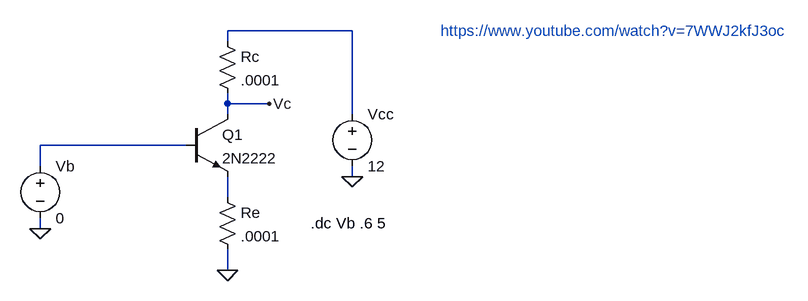
[diagram p0: schematic 2N2222A Input Characteristic Curve.asc]
2N2222A Input Characteristic Curve.asc, the LTspice schematic file:
Version 4
SHEET 1 1232 680
WIRE 448 16 256 16
WIRE 256 32 256 16
WIRE 256 128 256 112
WIRE 320 128 256 128
WIRE 256 144 256 128
WIRE 448 144 448 16
WIRE 192 192 -32 192
WIRE -32 224 -32 192
WIRE 448 240 448 224
WIRE 256 272 256 240
WIRE -32 320 -32 304
WIRE 256 384 256 352
FLAG 256 384 0
FLAG 448 240 0
FLAG 320 128 Vc
FLAG -32 320 0
SYMBOL npn 192 144 R0
SYMATTR InstName Q1
SYMATTR Value 2N2222
SYMBOL voltage 448 128 R0
WINDOW 123 0 0 Left 2
WINDOW 39 0 0 Left 2
SYMATTR InstName Vcc
SYMATTR Value 12
SYMBOL voltage -32 208 R0
SYMATTR InstName Vb
SYMATTR Value 0
SYMBOL res 240 16 R0
SYMATTR InstName Rc
SYMATTR Value .0001
SYMBOL res 240 256 R0
SYMATTR InstName Re
SYMATTR Value .0001
TEXT 384 312 Left 2 !.dc Vb .6 5
TEXT 584 16 Left 2 ;https://www.youtube.com/watch?v=7WWJ2kfJ3oc

The netlist it stands for:
* 2N2222A Input Characteristic Curve.asc
Q1 Vc N002 N003 0 2N2222
Vcc N001 0 12
Vb N002 0 0
Rc N001 Vc .0001
Re N003 0 .0001
.model NPN NPN
.model PNP PNP
.lib standard.bjt
.dc Vb .6 5
* https://www.youtube.com/watch?v=7WWJ2kfJ3oc
.backanno
.end